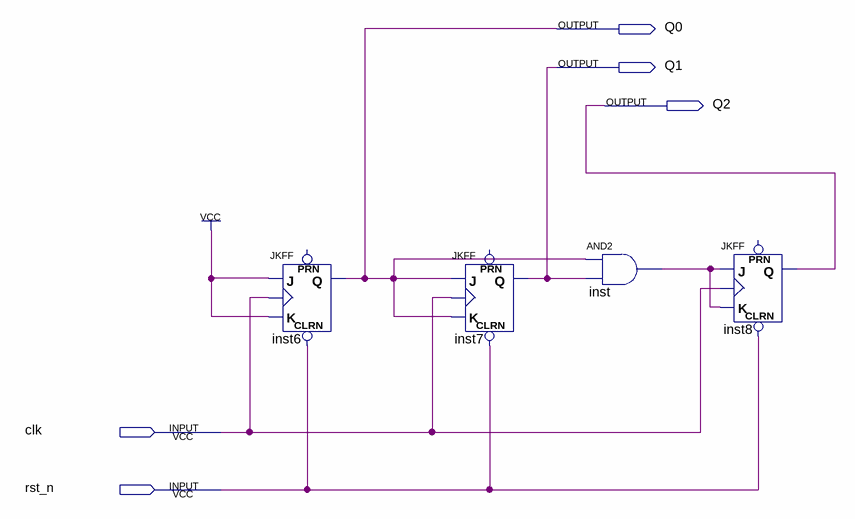
[diagram p0: schematic sheet]
// Quartus schematic count_8.bdf as structural Verilog: 4 symbols, 5 pins
module count_8 (
  input  clk,
  input  rst_n,
  output Q0,
  output Q1,
  output Q2
);

  wire inst_out;

  JKFF inst6 (.CLRN(rst_n), .K(1'b1), .J(1'b1), .CLK(clk), .Q(Q0));  // open: PRN
  JKFF inst7 (.CLRN(rst_n), .K(Q0), .J(Q0), .CLK(clk), .Q(Q1));  // open: PRN
  and inst (inst_out, Q0, Q1);
  JKFF inst8 (.CLRN(rst_n), .K(inst_out), .J(inst_out), .CLK(clk), .Q(Q2));  // open: PRN
endmodule
